# Altium schematic sheet [06] - QSFP28_1.SchDoc
size A3; DocumentNumber: 8; SheetNumber: 8; SheetTotal: 14
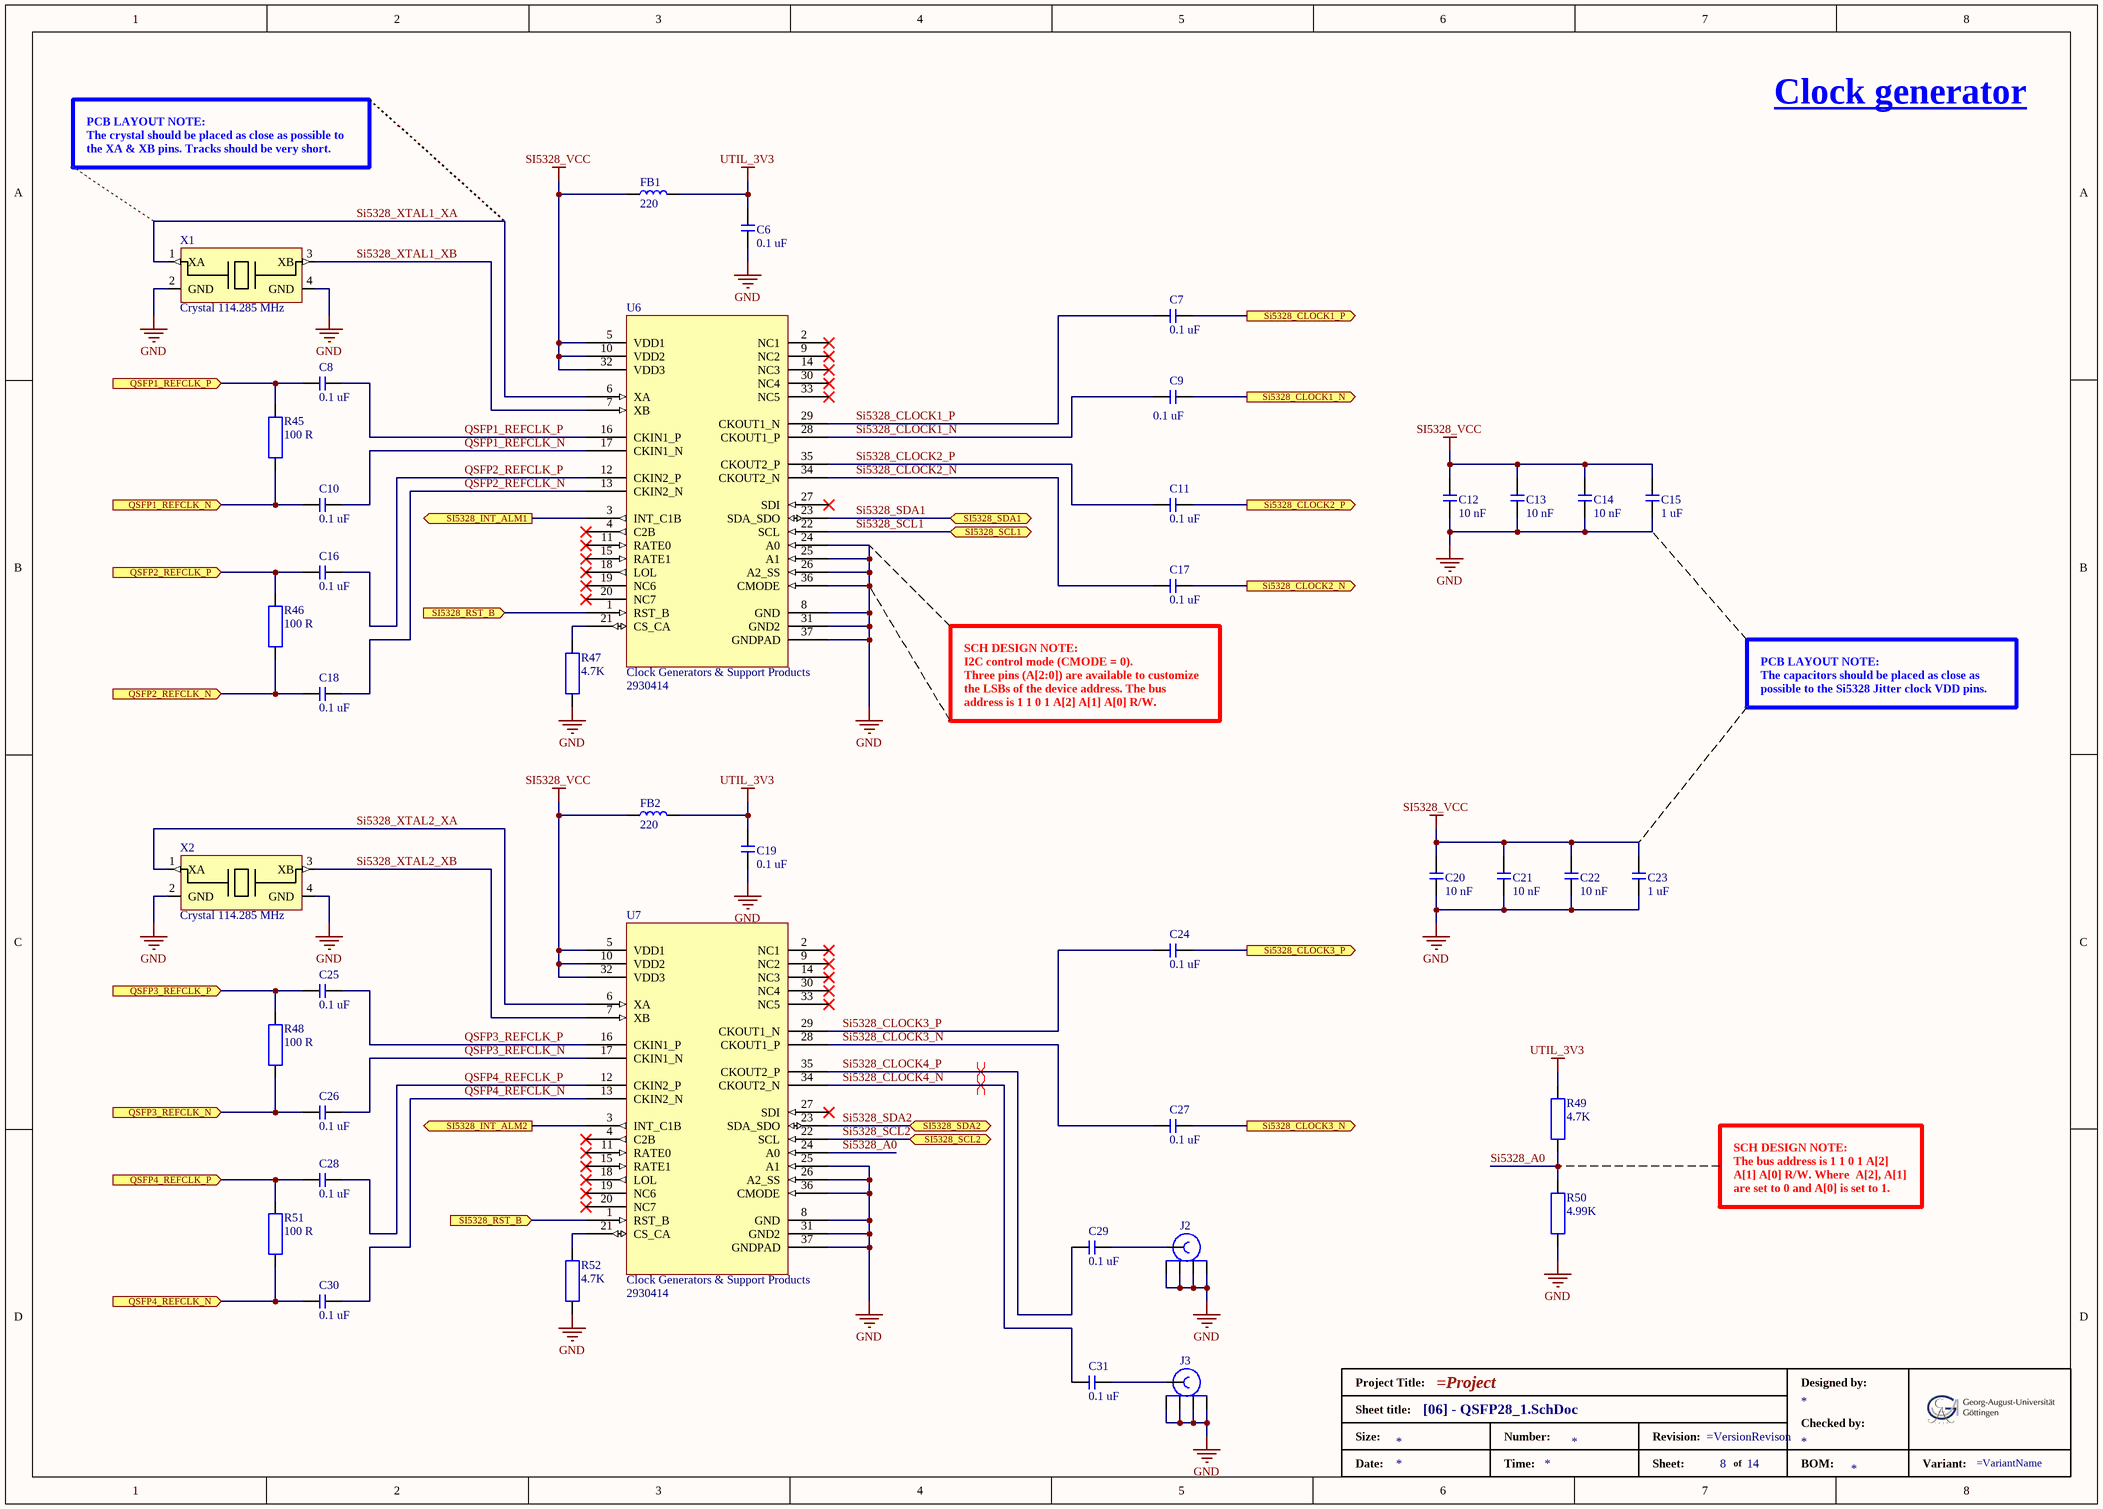
[diagram p0: [06] - QSFP28_1.SchDoc]

## Parts
*  Standard Title Block  (value not drawn)  (graphical)
C6  0.1 uF  [C0402]
C7  0.1 uF  [C0402]
C8  0.1 uF  [C0402]
C9  0.1 uF  [C0402]
C10  0.1 uF  [C0402]
C11  0.1 uF  [C0402]
C12  10 nF  [C0402]
C13  10 nF  [C0402]
C14  10 nF  [C0402]
C15  1 uF  [C0603]
C16  0.1 uF  [C0402]
C17  0.1 uF  [C0402]
C18  0.1 uF  [C0402]
C19  0.1 uF  [C0402]
C20  10 nF  [C0402]
C21  10 nF  [C0402]
C22  10 nF  [C0402]
C23  1 uF  [C0603]
C24  0.1 uF  [C0402]
C25  0.1 uF  [C0402]
C26  0.1 uF  [C0402]
C27  0.1 uF  [C0402]
C28  0.1 uF  [C0402]
C29  0.1 uF  [C0402]
C30  0.1 uF  [C0402]
C31  0.1 uF  [C0402]
FB1  220  [BEADC1608X75N]
FB2  220  [BEADC1608X75N]
J2  SMA-J-P-H_ST-EM1  [SAMTEC_SMA-J-P-H-ST-EM1]  (value not drawn)
J3  SMA-J-P-H_ST-EM1  [SAMTEC_SMA-J-P-H-ST-EM1]  (value not drawn)
R45  100 R  [R0402]
R46  100 R  [R0402]
R47  4.7K  [R0402]
R48  100 R  [R0402]
R49  4.7K  [R0402]
R50  4.99K  [R0402]
R51  100 R  [R0402]
R52  4.7K  [R0402]
U6  Clock Generators & Support Products  Supplier Part Number 1: 2930414  [QFN_50P600X600X90-37N-D]
U7  Clock Generators & Support Products  Supplier Part Number 1: 2930414  [QFN_50P600X600X90-37N-D]
X1  Crystal 114.285 MHz  [ABM8]
X2  Crystal 114.285 MHz  [ABM8]

## Ports
QSFP1_REFCLK_N (in), QSFP1_REFCLK_P (in), QSFP2_REFCLK_N (in), QSFP2_REFCLK_P (in), QSFP3_REFCLK_N (in), QSFP3_REFCLK_P (in), QSFP4_REFCLK_N (in), QSFP4_REFCLK_P (in), Si5328_CLOCK1_N (out), Si5328_CLOCK1_P (out), Si5328_CLOCK2_N (out), Si5328_CLOCK2_P (out), Si5328_CLOCK3_N (out), Si5328_CLOCK3_P (out), SI5328_INT_ALM1 (out), SI5328_INT_ALM2 (out), SI5328_RST_B (in), SI5328_SCL1 (bidir), SI5328_SCL2 (bidir), SI5328_SDA1 (bidir), SI5328_SDA2 (bidir)

## Nets
GND: C6.1 C12.1 C13.1 C14.1 C15.1 C19.1 C20.1 C21.1 C22.1 C23.1 J2.2 J2.3 J2.4 J2.5 J3.2 J3.3 J3.4 J3.5 R47.1 R50.1 R52.1 U6.8(GND) U6.24(A0) U6.25(A1) U6.26(A2_SS) U6.31(GND2) U6.36(CMODE) U6.37(GNDPAD) U7.8(GND) U7.25(A1) U7.26(A2_SS) U7.31(GND2) U7.36(CMODE) U7.37(GNDPAD) X1.2(GND) X1.4(GND) X2.2(GND) X2.4(GND)
SI5328_VCC: C12.2 C13.2 C14.2 C15.2 C20.2 C21.2 C22.2 C23.2 FB1.1 FB2.1 U6.5(VDD1) U6.10(VDD2) U6.32(VDD3) U7.5(VDD1) U7.10(VDD2) U7.32(VDD3)
UTIL_3V3: C6.2 C19.2 FB1.2 FB2.2 R49.2
QSFP1_REFCLK_N: C10.1 R45.1 ; port QSFP1_REFCLK_N
QSFP1_REFCLK_N: C10.2 U6.17(CKIN1_N)  [a separate net that carries the same name]
QSFP1_REFCLK_P: C8.1 R45.2 ; port QSFP1_REFCLK_P
QSFP1_REFCLK_P: C8.2 U6.16(CKIN1_P)  [a separate net that carries the same name]
QSFP2_REFCLK_N: C18.1 R46.1 ; port QSFP2_REFCLK_N
QSFP2_REFCLK_N: C18.2 U6.13(CKIN2_N)  [a separate net that carries the same name]
QSFP2_REFCLK_P: C16.1 R46.2 ; port QSFP2_REFCLK_P
QSFP2_REFCLK_P: C16.2 U6.12(CKIN2_P)  [a separate net that carries the same name]
QSFP3_REFCLK_N: C26.1 R48.1 ; port QSFP3_REFCLK_N
QSFP3_REFCLK_N: C26.2 U7.17(CKIN1_N)  [a separate net that carries the same name]
QSFP3_REFCLK_P: C25.1 R48.2 ; port QSFP3_REFCLK_P
QSFP3_REFCLK_P: C25.2 U7.16(CKIN1_P)  [a separate net that carries the same name]
QSFP4_REFCLK_N: C30.1 R51.1 ; port QSFP4_REFCLK_N
QSFP4_REFCLK_N: C30.2 U7.13(CKIN2_N)  [a separate net that carries the same name]
QSFP4_REFCLK_P: C28.1 R51.2 ; port QSFP4_REFCLK_P
QSFP4_REFCLK_P: C28.2 U7.12(CKIN2_P)  [a separate net that carries the same name]
Si5328_A0: R49.1 R50.2 U7.24(A0)
Si5328_CLOCK1_N: C9.1 U6.28(CKOUT1_P)
Si5328_CLOCK1_N: C9.2 ; port Si5328_CLOCK1_N  [a separate net that carries the same name]
Si5328_CLOCK1_P: C7.1 U6.29(CKOUT1_N)
Si5328_CLOCK1_P: C7.2 ; port Si5328_CLOCK1_P  [a separate net that carries the same name]
Si5328_CLOCK2_N: C17.1 U6.34(CKOUT2_N)
Si5328_CLOCK2_N: C17.2 ; port Si5328_CLOCK2_N  [a separate net that carries the same name]
Si5328_CLOCK2_P: C11.1 U6.35(CKOUT2_P)
Si5328_CLOCK2_P: C11.2 ; port Si5328_CLOCK2_P  [a separate net that carries the same name]
Si5328_CLOCK3_N: C27.1 U7.28(CKOUT1_P)
Si5328_CLOCK3_N: C27.2 ; port Si5328_CLOCK3_N  [a separate net that carries the same name]
Si5328_CLOCK3_P: C24.1 U7.29(CKOUT1_N)
Si5328_CLOCK3_P: C24.2 ; port Si5328_CLOCK3_P  [a separate net that carries the same name]
Si5328_CLOCK4_N: C31.1 U7.34(CKOUT2_N)
Si5328_CLOCK4_P: C29.1 U7.35(CKOUT2_P)
SI5328_INT_ALM1: U6.3(INT_C1B) ; port SI5328_INT_ALM1
SI5328_INT_ALM2: U7.3(INT_C1B) ; port SI5328_INT_ALM2
SI5328_RST_B: U6.1(RST_B) U7.1(RST_B) ; port SI5328_RST_B
Si5328_SCL1: U6.22(SCL) ; port SI5328_SCL1
Si5328_SCL2: U7.22(SCL) ; port SI5328_SCL2
Si5328_SDA1: U6.23(SDA_SDO) ; port SI5328_SDA1
Si5328_SDA2: U7.23(SDA_SDO) ; port SI5328_SDA2
Si5328_XTAL1_XA: U6.6(XA) X1.1(XA)
Si5328_XTAL1_XB: U6.7(XB) X1.3(XB)
Si5328_XTAL2_XA: U7.6(XA) X2.1(XA)
Si5328_XTAL2_XB: U7.7(XB) X2.3(XB)
NetC29_2: C29.2 J2.1
NetC31_2: C31.2 J3.1
NetR47_2: R47.2 U6.21(CS_CA)
NetR52_2: R52.2 U7.21(CS_CA)

Not connected (* = marked no-connect by the designer): U6 2(NC1)* 4(C2B)* 9(NC2)* 11(RATE0)* 14(NC3)* 15(RATE1)* 18(LOL)* 19(NC6)* 20(NC7)* 27(SDI)* 30(NC4)* 33(NC5)*; U7 2(NC1)* 4(C2B)* 9(NC2)* 11(RATE0)* 14(NC3)* 15(RATE1)* 18(LOL)* 19(NC6)* 20(NC7)* 27(SDI)* 30(NC4)* 33(NC5)*

## Layout directives
differential pair: Si5328_CLOCK4_N, Si5328_CLOCK4_P

## Notes on the sheet
- Clock generator
- PCB LAYOUT NOTE:
  The crystal should be placed as close as possible to the XA & XB pins. Tracks should be very short.
- SCH DESIGN NOTE:
  I2C control mode (CMODE = 0).
  Three pins (A[2:0]) are available to customize the LSBs of the device address. The bus address is 1 1 0 1 A[2] A[1] A[0] R/W.
- PCB LAYOUT NOTE:
  The capacitors should be placed as close as possible to the Si5328 Jitter clock VDD pins.
- SCH DESIGN NOTE:
  The bus address is 1 1 0 1 A[2] A[1] A[0] R/W. Where  A[2], A[1] are set to 0 and A[0] is set to 1.
- Title
- Size:
- Date:
- A4
- Number:
- Time:
- Revision:
- Sheet
- of
- File:
- (in symbol Title_Block) Project Title:; Designed by:; Sheet title:; Checked by:; Size:; Number:; Revision:; Date:; Time:; Sheet:; of; BOM:; Variant:

## Library data of the parts
* = Title_Block: Size: *; BOM: *; DesignedBy: *; DW: *; CheckedBy: *
C6-C11 C16-C19 C24-C31 = UMK105B7104KV-FR: Cap 0402 0.1 uF 50 V ±10 % Tolerance X7R Surface Mount Multilayer Ceramic Capacitor; Manufacturer: Taiyo Yuden; Voltage Rating: 50V; Capacitance: 100nF; Tolerance: 10%; Supplier 1: Rs; Manufacturer Part Number: UMK105B7104KV-FR; RoHS: Yes; Category: Ceramic Capacitors; Stock 1: 60000; Pricing 1: 10000=0.016 (EUR); Mount: Surface Mount; Case/Package: 0402; Case Code (Imperial): 0402; Case Code (Metric): 1005; Min Operating Temperature: -55°C; Max Operating Temperature: 125°C; Voltage Rating (DC): 50V; Packaging: Tape and Reel; Package Quantity: 1; Dielectric: X7R; Termination: SMD/SMT; Series: M; Length: 0.039inch; Width: 0.02inch; Height: 0.5mm; Thickness: 0.022inch; Lead Free: Lead Free; Halogen Free: Halogen Free; RoHS Compliant: Yes; ComponentLink1URL: https://datasheet.ciiva.com/24356/619umk105b7104kv-fr-24356845.pdf?src-supplier=Onlinecomponents.com; ComponentLink1Description: https://datasheet.ciiva.com/24356/619umk105b7104kv-fr-24356845.pdf?src-supplier=Onlinecomponents.com; ComponentLink2URL: https://datasheet.ciiva.com/30180/52umk105b7104kv-fr-30180098.pdf?src-supplier=Onlinecomponents.com; ComponentLink2Description: https://datasheet.ciiva.com/30180/52umk105b7104kv-fr-30180098.pdf?src-supplier=Onlinecomponents.com; ComponentLink3URL: https://datasheet.ciiva.com/18697/mlcc-all-e-18697452.pdf?src-supplier=Digi-Key; ComponentLink3Description: https://datasheet.ciiva.com/18697/mlcc-all-e-18697452.pdf?src-supplier=Digi-Key; ComponentLink4URL: https://datasheet.ciiva.com/18697/mlcc-all-e-18697451.pdf?src-supplier=Digi-Key; ComponentLink4Description: https://datasheet.ciiva.com/18697/mlcc-all-e-18697451.pdf?src-supplier=Digi-Key; ComponentLink5URL: https://datasheet.ciiva.com/18697/mlcc-all-e-18697453.pdf?src-supplier=Digi-Key; ComponentLink5Description: https://datasheet.ciiva.com/18697/mlcc-all-e-18697453.pdf?src-supplier=Digi-Key; Supplier Part Number 1: 1782869
C12-C14 C20-C22 = C0402C103K3RACTU: Cap Multilayer Ceramic Capacitors MLCC - SMD/SMT 25volts 10000pF X7R 10%; Manufacturer: KEMET; Capacitance: 10nF; Voltage Rating (DC): 25V; Dissipation Factor: 3.5%; Supplier 1: Mouser; Manufacturer Part Number: C0402C103K3RACTU; RoHS: Yes; Category: Ceramic Capacitors; Stock 1: 1004059; Pricing 1: 1=0.1, 10=0.018, 50=0.018, 100=0.008, 1000=0.006, 10000=0.003 (USD); Mount: Surface Mount; Case/Package: 0402; Number of Pins: 2; Case Code (Imperial): 0402; Case Code (Metric): 1005; Min Operating Temperature: -55°C; Max Operating Temperature: 125°C; Tolerance: 10%; Packaging: Tape and Reel; Dielectric: X7R; Voltage Rating: 25V; Package Quantity: 10000; Termination: SMD/SMT; Series: SMD Comm X7R; Construction: Flat; Length: 1mm; Width: 0.5mm; Height: 0.5mm; Depth: 0.5mm; Lead Pitch: 0.3mm; Radiation Hardening: No; RoHS Compliant: Yes; Reach SVHC Compliant: No; ComponentLink1URL: https://datasheet.ciiva.com/7747/kem-c1002-x7r-smd-7747612.pdf?src-supplier=Element14; ComponentLink1Description: https://datasheet.ciiva.com/7747/kem-c1002-x7r-smd-7747612.pdf?src-supplier=Element14; ComponentLink2URL: https://datasheet.ciiva.com/45846/docfinderpartnumberc0402c102k5ractu-45846917.pdf?src-supplier=Onlinecomponents.com; ComponentLink2Description: https://datasheet.ciiva.com/45846/docfinderpartnumberc0402c102k5ractu-45846917.pdf?src-supplier=Onlinecomponents.com; ComponentLink3URL: https://datasheet.ciiva.com/18192/getdatasheetpartid-330802-18192396.pdf?src-supplier=Verical; ComponentLink3Description: https://datasheet.ciiva.com/18192/getdatasheetpartid-330802-18192396.pdf?src-supplier=Verical; Supplier Part Number 1: 80-C0402C103K3R
C15 C23 = C0603C105K3RACTU: Cap Ceramic 1uF 25V X7R 10% Pad SMD 0603 125°C T/R; Manufacturer: KEMET; Dissipation Factor: 5%; Supplier 1: Mouser; Manufacturer Part Number: C0603C105K3RACTU; RoHS: Yes; Category: Ceramic Capacitors; Stock 1: 684247; Pricing 1: 1=0.29, 10=0.172, 50=0.172, 100=0.095, 1000=0.068, 10000=0.053 (USD); Mount: Surface Mount; Case/Package: 0603; Case Code (Metric): 1608; Case Code (Imperial): 0603; Dielectric Material: Ceramic; Min Operating Temperature: -55°C; Max Operating Temperature: 125°C; Capacitance: 1uF; Tolerance: 10%; Voltage Rating: 25V; Packaging: Tape and Reel; Package Quantity: 4000; Voltage Rating (DC): 25V; Dielectric: X7R; Termination: SMD/SMT; Voltage: 25V; Series: SMD Comm X7R; Construction: Flat; Length: 1.6mm; Width: 0.8mm; Height: 0.8mm; Depth: 0.8mm; Reach SVHC Compliant: No; RoHS Compliant: Yes; ComponentLink1URL: https://datasheet.ciiva.com/7823/1851736-7823596.pdf?src-supplier=Element14; ComponentLink1Description: https://datasheet.ciiva.com/7823/1851736-7823596.pdf?src-supplier=Element14; Supplier Part Number 1: 80-C0603C105K3R
FB1 FB2 = MPZ1608S221ATA00: 0603 220Ω ±25% DCR=0.050Ω 2.2A; Manufacturer: TDK; Core Material: Ferrite; Impedance: 220R; DC Resistance (DCR): 50mR; Number of Lines: 1; Supplier 1: Farnell; Manufacturer Part Number: MPZ1608S221ATA00; RoHS: Yes; Category: Ferrite Beads and Chips; Stock 1: 256000; Pricing 1: 4000=0.0235, 20000=0.023, 40000=0.0226 (EUR); Mount: Surface Mount; Case/Package: 0603; Number of Pins: 2; Case Code (Imperial): 0603; Case Code (Metric): 1608; Tolerance: 25%; Packaging: Cut Tape; Package Quantity: 1; Max DC Current: 2.2A; Series: MPZ; Current Rating: 2.2A; Max Current Rating: 2.2A; Length: 0.063inch; Width: 0.031inch; Height: 0.037inch; RoHS Compliant: Yes; Lead Free: Lead Free; Reach SVHC Compliant: No; ComponentLink1URL: https://datasheet.ciiva.com/8077/55167-8077073.pdf?src-supplier=Element14; ComponentLink1Description: https://datasheet.ciiva.com/8077/55167-8077073.pdf?src-supplier=Element14; ComponentLink2URL: https://datasheet.ciiva.com/8077/55167-8077071.pdf?src-supplier=Element14; ComponentLink2Description: https://datasheet.ciiva.com/8077/55167-8077071.pdf?src-supplier=Element14; ComponentLink3URL: https://datasheet.ciiva.com/46381/1486324-46381628.pdf?src-supplier=Element14; ComponentLink3Description: https://datasheet.ciiva.com/46381/1486324-46381628.pdf?src-supplier=Element14; ComponentLink4URL: https://datasheet.ciiva.com/46366/print-detail-pdf-phplangenpart-nompz1608s221ata00nreimp-unit-xmhz-46366044.pdf?src-supplier=Onlinecomponents.com; ComponentLink4Description: https://datasheet.ciiva.com/46366/print-detail-pdf-phplangenpart-nompz1608s221ata00nreimp-unit-xmhz-46366044.pdf?src-supplier=Onlinecomponents.com; Supplier Part Number 1: 2800773
J2 J3 = SMA-J-P-H-ST-EM1: RF Connectors / Coaxial Connectors 6 GHz, 50 Ohm SMA Jack or Plug, Cable Connector; Manufacturer: Samtec; Body Material: Brass; Body Plating: Gold; Dielectric Material: PTFE; Impedance: 50R; Max Frequency: 20GHz; Voltage Rating: 335V; Number of Ports: 1; Number of Contacts: 1NUMBER; Supplier 1: Rs; Manufacturer Part Number: SMA-J-P-H-ST-EM1; RoHS: Yes; Category: RF / Coaxial Connectors; Stock 1: 33; Pricing 1: 1=5.76, 10=4.18, 50=3.98, 100=3.83, 500=2.76 (EUR); Mount: Edge,Board; Case/Package: SMA; Contact Material: Copper; Contact Plating: Gold; Housing Color: Gold; Insulation Material: Polytetrafluoroethylene; Center Contact Plating: Gold; Min Operating Temperature: -65°C; Max Operating Temperature: 125°C; Termination: Solder; Orientation: Straight; Packaging: Tray; Package Quantity: 1; Fastening Type: Threaded; Connector Type: SMA; Series: -; Frequency: 20GHz; Length: 6.35mm; Depth: 13.33mm; Radiation Hardening: No; RoHS Compliant: Yes; ComponentLink1URL: https://datasheet.ciiva.com/646/sma-j-p-x-st-em1-mkt-646053.pdf?src-supplier=Digikey; ComponentLink1Description: https://datasheet.ciiva.com/646/sma-j-p-x-st-em1-mkt-646053.pdf?src-supplier=Digikey; Supplier Part Number 1: 1592304
R45 R46 R48 R51 = ERJ-2RKF1000X: RES Thick Film 0402 100 Ohm 1% 1/10W 100ppm/C Molded SMD Punched Carrier T/R; Manufacturer: Panasonic; Resistance: 100R; Temperature Coefficient: 100ppm/°C; Power Rating: 100mW; Voltage Rating: 50V; Supplier 1: Mouser; Manufacturer Part Number: ERJ-2RKF1000X; RoHS: Yes; Category: Chip SMD Resistors; Stock 1: 11989335; Pricing 1: 1=0.1, 10=0.017, 50=0.017, 100=0.008, 1000=0.006, 10000=0.004 (USD); Mount: Surface Mount; Case/Package: 0402; Number of Pins: 2; Contact Plating: Tin; Case Code (Imperial): 0402; Case Code (Metric): 1005; Size Code: 0402; Min Operating Temperature: -55°C; Max Operating Temperature: 155°C; Tolerance: 1%; Resistor Type: Thick Film; Packaging: Tape and Reel; Package Quantity: 1; Termination: SMD/SMT; Number of Terminations: 2; Max Power Dissipation: 100mW; Voltage Rating (DC): 50V; Features: Automotive AEC-Q200; Series: ERJ; Technology: THICK FILM; Resistance Tolerance: 1%; Construction: Rectangular; Length: 1mm; Width: 0.5mm; Height: 0.35mm; Depth: 0.5mm; Radiation Hardening: No; Reach SVHC Compliant: No; Military Standard: Not; Lead Free: Lead Free; RoHS Compliant: Yes; ComponentLink1URL: https://datasheet.ciiva.com/27056/2007311-27056035.pdf?src-supplier=Jameco; ComponentLink1Description: https://datasheet.ciiva.com/27056/2007311-27056035.pdf?src-supplier=Jameco; ComponentLink2URL: https://datasheet.ciiva.com/11821/0900766b80f80784-11821173.pdf?src-supplier=Rs; ComponentLink2Description: https://datasheet.ciiva.com/11821/0900766b80f80784-11821173.pdf?src-supplier=Rs; ComponentLink3URL: https://datasheet.ciiva.com/7830/426256-7830973.pdf?src-supplier=Element14; ComponentLink3Description: https://datasheet.ciiva.com/7830/426256-7830973.pdf?src-supplier=Element14; ComponentLink4URL: https://datasheet.ciiva.com/43467/1678782-43467223.pdf?src-supplier=Farnell; ComponentLink4Description: https://datasheet.ciiva.com/43467/1678782-43467223.pdf?src-supplier=Farnell; ComponentLink5URL: https://datasheet.ciiva.com/28514/1678782-28514175.pdf?src-supplier=Element14; ComponentLink5Description: https://datasheet.ciiva.com/28514/1678782-28514175.pdf?src-supplier=Element14; ComponentLink6URL: https://datasheet.ciiva.com/46372/1678782-46372741.pdf?src-supplier=Element14; ComponentLink6Description: https://datasheet.ciiva.com/46372/1678782-46372741.pdf?src-supplier=Element14; ComponentLink7URL: https://datasheet.ciiva.com/16776/70260748-16776427.pdf?src-supplier=Allied+Electronics; ComponentLink7Description: https://datasheet.ciiva.com/16776/70260748-16776427.pdf?src-supplier=Allied+Electronics; ComponentLink8URL: https://datasheet.ciiva.com/9186/aoa0000ce2-9186683.pdf?src-supplier=Avnet; ComponentLink8Description: https://datasheet.ciiva.com/9186/aoa0000ce2-9186683.pdf?src-supplier=Avnet; ComponentLink9URL: https://datasheet.ciiva.com/16199/aoa0000ce2-16199575.pdf?src-supplier=Future+Electronics; ComponentLink9Description: https://datasheet.ciiva.com/16199/aoa0000ce2-16199575.pdf?src-supplier=Future+Electronics; ComponentLink10URL: https://datasheet.ciiva.com/48531/aoa0000ce2-48531067.pdf?src-supplier=Avnet; ComponentLink10Description: https://datasheet.ciiva.com/48531/aoa0000ce2-48531067.pdf?src-supplier=Avnet; ComponentLink11URL: https://datasheet.ciiva.com/30260/aoa0000ce2-30260809.pdf?src-supplier=Onlinecomponents.com; ComponentLink11Description: https://datasheet.ciiva.com/30260/aoa0000ce2-30260809.pdf?src-supplier=Onlinecomponents.com; Supplier Part Number 1: 667-ERJ-2RKF1000X
R47 R49 R52 = ERJ-2RKF4701X: RES Thick Film 0402 4.7K Ohm 1% 1/10W ±100ppm/°C Molded SMD Punched Carrier T/R; Manufacturer: Panasonic; Resistance: 4.7kR; Power Rating: 100mW; Voltage Rating: 50V; Supplier 1: Mouser; Manufacturer Part Number: ERJ-2RKF4701X; RoHS: Yes; Category: Chip SMD Resistors; Stock 1: 4815685; Pricing 1: 1=0.1, 10=0.018, 50=0.018, 100=0.008, 1000=0.006, 10000=0.003 (USD); Case Code (Metric): 1005; Case Code (Imperial): 0402; Weight: 0.000388oz; Min Operating Temperature: -55°C; Max Operating Temperature: 155°C; Tolerance: 1%; Temperature Coefficient: 100ppm/°C; Packaging: Cut Tape; Package Quantity: 10000; Termination: SMD/SMT; Voltage Rating (DC): 50V; Series: ERJ-2Rx; Technology: THICK FILM; Length: 1mm; Width: 0.5mm; Height: 0.35mm; Lead Free: Lead Free; RoHS Compliant: Yes; ComponentLink1URL: https://datasheet.ciiva.com/11821/0900766b80f80784-11821329.pdf?src-supplier=Rs; ComponentLink1Description: https://datasheet.ciiva.com/11821/0900766b80f80784-11821329.pdf?src-supplier=Rs; ComponentLink2URL: https://datasheet.ciiva.com/7830/aoa0000ce2-7830727.pdf?src-supplier=Element14; ComponentLink2Description: https://datasheet.ciiva.com/7830/aoa0000ce2-7830727.pdf?src-supplier=Element14; ComponentLink3URL: https://datasheet.ciiva.com/22781/1678782-22781576.pdf?src-supplier=Farnell; ComponentLink3Description: https://datasheet.ciiva.com/22781/1678782-22781576.pdf?src-supplier=Farnell; ComponentLink4URL: https://datasheet.ciiva.com/22667/1678782-22667886.pdf?src-supplier=Element14; ComponentLink4Description: https://datasheet.ciiva.com/22667/1678782-22667886.pdf?src-supplier=Element14; ComponentLink5URL: https://datasheet.ciiva.com/22723/1678782-22723903.pdf?src-supplier=Element14; ComponentLink5Description: https://datasheet.ciiva.com/22723/1678782-22723903.pdf?src-supplier=Element14; ComponentLink6URL: https://datasheet.ciiva.com/24025/aoa0000ce2-24025663.pdf?src-supplier=Mouser; ComponentLink6Description: https://datasheet.ciiva.com/24025/aoa0000ce2-24025663.pdf?src-supplier=Mouser; ComponentLink7URL: https://datasheet.ciiva.com/16763/70260748-16763151.pdf?src-supplier=Allied+Electronics; ComponentLink7Description: https://datasheet.ciiva.com/16763/70260748-16763151.pdf?src-supplier=Allied+Electronics; ComponentLink8URL: https://datasheet.ciiva.com/9195/aoa0000ce2-9195737.pdf?src-supplier=Avnet; ComponentLink8Description: https://datasheet.ciiva.com/9195/aoa0000ce2-9195737.pdf?src-supplier=Avnet; ComponentLink9URL: https://datasheet.ciiva.com/30053/aoa0000ce2-30053990.pdf?src-supplier=Onlinecomponents.com; ComponentLink9Description: https://datasheet.ciiva.com/30053/aoa0000ce2-30053990.pdf?src-supplier=Onlinecomponents.com; Supplier Part Number 1: 667-ERJ-2RKF4701X
R50 = ERJ-2RKF4991X: RES SMD 4.99K OHM 1% 1/10W 0402; Manufacturer: Panasonic; Resistance: 4.99kR; Power Rating: 100mW; Voltage Rating: 50V; Temperature Coefficient: 100ppm/°C; Supplier 1: Mouser; Manufacturer Part Number: ERJ-2RKF4991X; RoHS: Yes; Category: Chip SMD Resistors; Stock 1: 1218727; Pricing 1: 1=0.1, 10=0.018, 50=0.018, 100=0.008, 1000=0.006, 10000=0.004 (USD); Mount: Surface Mount; Case/Package: 0402; Case Code (Metric): 1005; Case Code (Imperial): 0402; Contact Plating: Tin; Weight: 2.8E-05oz; Min Operating Temperature: -55°C; Max Operating Temperature: 155°C; Tolerance: 1%; Packaging: Tape and Reel; Package Quantity: 1; Resistor Type: Thick Film; Number of Terminations: 2; Termination: SMD/SMT; Max Power Dissipation: 100mW; Voltage Rating (DC): 50V; Features: Automotive AEC-Q200; Series: ERJ; Resistance Tolerance: 1%; Construction: Rectangular; Working Voltage: 50V; Technology: THICK FILM; Length: 1mm; Width: 0.5mm; Height: 0.016inch; Depth: 0.5mm; Radiation Hardening: No; Reach SVHC Compliant: No; Military Standard: Not; Lead Free: Lead Free; RoHS Compliant: Yes; ComponentLink1URL: https://datasheet.ciiva.com/46388/426256-46388311.pdf?src-supplier=Element14; ComponentLink1Description: https://datasheet.ciiva.com/46388/426256-46388311.pdf?src-supplier=Element14; ComponentLink2URL: https://datasheet.ciiva.com/46376/426256-46376955.pdf?src-supplier=Element14; ComponentLink2Description: https://datasheet.ciiva.com/46376/426256-46376955.pdf?src-supplier=Element14; ComponentLink3URL: https://datasheet.ciiva.com/22749/1678782-22749654.pdf?src-supplier=Element14; ComponentLink3Description: https://datasheet.ciiva.com/22749/1678782-22749654.pdf?src-supplier=Element14; ComponentLink4URL: https://datasheet.ciiva.com/24158/aoa0000ce2-24158871.pdf?src-supplier=Mouser; ComponentLink4Description: https://datasheet.ciiva.com/24158/aoa0000ce2-24158871.pdf?src-supplier=Mouser; ComponentLink5URL: https://datasheet.ciiva.com/16775/70260748-16775018.pdf?src-supplier=Allied+Electronics; ComponentLink5Description: https://datasheet.ciiva.com/16775/70260748-16775018.pdf?src-supplier=Allied+Electronics; ComponentLink6URL: https://datasheet.ciiva.com/16773/70260748-16773110.pdf?src-supplier=Allied+Electronics; ComponentLink6Description: https://datasheet.ciiva.com/16773/70260748-16773110.pdf?src-supplier=Allied+Electronics; ComponentLink7URL: https://datasheet.ciiva.com/16199/aoa0000ce2-16199546.pdf?src-supplier=Future+Electronics; ComponentLink7Description: https://datasheet.ciiva.com/16199/aoa0000ce2-16199546.pdf?src-supplier=Future+Electronics; Supplier Part Number 1: 667-ERJ-2RKF4991X
U6 U7 = SI5328B-C-GM: Synchronous Ethernet Jitter Attenuating Clock Multiplier Single 0.008 MHz to 710MHz 36-Pin QFN; Manufacturer: Silicon Labs; Supplier 1: Farnell; Manufacturer Part Number: SI5328B-C-GM; RoHS: Yes; Category: Clock and Timing; Pricing 1: 1=16.74, 10=16.37, 25=16, 50=15.63, 100=15.32 (EUR); ComponentLink1URL: https://datasheet.ciiva.com/29898/si5328-29898491.pdf?src-supplier=Avnet; ComponentLink1Description: https://datasheet.ciiva.com/29898/si5328-29898491.pdf?src-supplier=Avnet
X1 X2 = ABM8-166-114.285MHZ-T2: ABM8 Series 114.285 MHz ±20ppm 18pF -40 to +85 °C Ultra Miniature Ceramic Crysta; Manufacturer: Abracon; ESR (Equivalent Series Resistance): 80R; Supplier 1: Rs; Manufacturer Part Number: ABM8-166-114.285MHZ-T2; RoHS: Yes; Category: Crystals; Stock 1: 3926; Pricing 1: 2=1.675, 50=3.52, 100=3.075, 250=3.04, 500=2.98 (EUR); Mount: Surface Mount; Case/Package: SMD/SMT; Number of Pins: 4; Min Operating Temperature: -40°C; Max Operating Temperature: 85°C; Packaging: Cut Tape; Frequency Tolerance: 20ppm; Load Capacitance: 18pF; Frequency: 114.285MHz; Series Resistance: 80R; Frequency Stability: 20ppm; Series: ABM8; Lead Free: Lead Free; RoHS Compliant: Yes; ComponentLink1URL: https://datasheet.ciiva.com/29632/abm8-166-29632188.pdf?src-supplier=Digi-Key; ComponentLink1Description: https://datasheet.ciiva.com/29632/abm8-166-29632188.pdf?src-supplier=Digi-Key; ComponentLink2URL: https://datasheet.ciiva.com/29632/abm8-166-29632187.pdf?src-supplier=Digi-Key; ComponentLink2Description: https://datasheet.ciiva.com/29632/abm8-166-29632187.pdf?src-supplier=Digi-Key; ComponentLink3URL: https://datasheet.ciiva.com/29632/abm8-166-29632189.pdf?src-supplier=Digi-Key; ComponentLink3Description: https://datasheet.ciiva.com/29632/abm8-166-29632189.pdf?src-supplier=Digi-Key; Supplier Part Number 1: 1712823